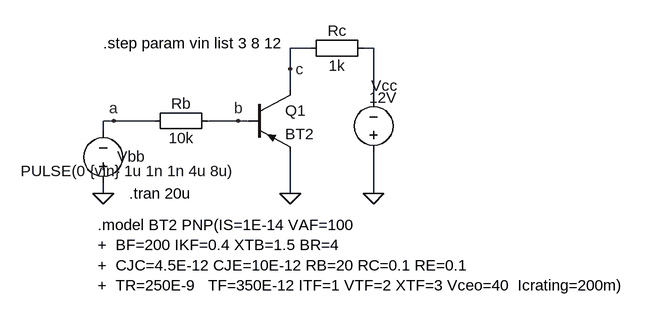
[diagram p0: schematic ce-switch-vin-pnp.asc]
ce-switch-vin-pnp.asc, the LTspice schematic file:
Version 4
SHEET 1 880 680
WIRE 240 16 208 16
WIRE 336 16 320 16
WIRE 208 48 208 16
WIRE 208 80 208 48
WIRE 336 96 336 16
WIRE -64 128 -80 128
WIRE 0 128 -64 128
WIRE 128 128 80 128
WIRE 144 128 128 128
WIRE -80 144 -80 128
WIRE -80 240 -80 224
WIRE 208 240 208 176
WIRE 336 240 336 176
FLAG 208 240 0
FLAG -80 240 0
FLAG 336 240 0
FLAG 128 128 b
FLAG 208 48 c
FLAG -64 128 a
SYMBOL Misc\\EuropeanResistor 336 0 R90
WINDOW 0 5 56 VBottom 2
WINDOW 3 27 56 VTop 2
SYMATTR InstName Rc
SYMATTR Value 1k
SYMBOL Misc\\EuropeanResistor 96 112 R90
WINDOW 0 5 56 VBottom 2
WINDOW 3 27 56 VTop 2
SYMATTR InstName Rb
SYMATTR Value 10k
SYMBOL voltage -80 240 R180
WINDOW 3 -204 35 Left 2
WINDOW 123 0 0 Left 2
WINDOW 39 0 0 Left 2
WINDOW 0 -64 57 Left 2
SYMATTR Value PULSE(0 {vin} 1u 1n 1n 4u 8u)
SYMATTR InstName Vbb
SYMBOL voltage 336 192 R180
WINDOW 3 -36 100 Left 2
WINDOW 123 0 0 Left 2
WINDOW 39 0 0 Left 2
WINDOW 0 -36 118 Left 2
SYMATTR Value 12V
SYMATTR InstName Vcc
SYMBOL pnp 144 80 R0
SYMATTR InstName Q1
SYMATTR Value BT2
TEXT -40 240 Left 2 !.tran 20u
TEXT -80 8 Left 2 !.step param vin list 3 8 12
TEXT -88 288 Left 2 !.model BT2 PNP(IS=1E-14 VAF=100\n+  BF=200 IKF=0.4 XTB=1.5 BR=4\n+  CJC=4.5E-12 CJE=10E-12 RB=20 RC=0.1 RE=0.1\n+  TR=250E-9   TF=350E-12 ITF=1 VTF=2 XTF=3 Vceo=40  Icrating=200m)

The netlist it stands for:
* ce-switch-vin-pnp.asc
Rc N001 c 1k
Rb b a 10k
Vbb 0 a PULSE(0 {vin} 1u 1n 1n 4u 8u)
Vcc 0 N001 12V
Q1 c b 0 0 BT2
.model NPN NPN
.model PNP PNP
.lib standard.bjt
.tran 20u
.step param vin list 3 8 12
.model BT2 PNP(IS=1E-14 VAF=100
+  BF=200 IKF=0.4 XTB=1.5 BR=4
+  CJC=4.5E-12 CJE=10E-12 RB=20 RC=0.1 RE=0.1
+  TR=250E-9   TF=350E-12 ITF=1 VTF=2 XTF=3 Vceo=40  Icrating=200m)
.backanno
.end